# Altium schematic sheet IMU.SchDoc
size A4; Organization: Altium Limited; Address1: L3, 12a Rodborough Rd; Address2: Frenchs Forest; Address3: NSW; Address4: Australia 2086
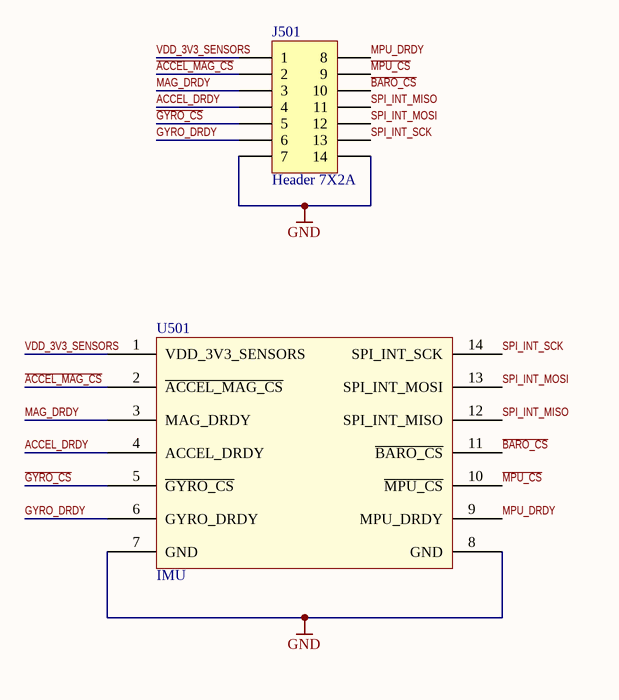
[diagram p0: IMU.SchDoc]

## Parts
J501  Header 7X2A  [smt connecter1.27-15]
U501  IMU  [IMU]

## Nets
GND: J501.7 J501.14 U501.7(GND) U501.8(GND)
~{ACCEL_MAG_CS}: J501.2 U501.2(~{ACCEL_MAG_CS})
ACCEL_DRDY: J501.4 U501.4(ACCEL_DRDY)
~{BARO_CS}: J501.10 U501.11(~{BARO_CS})
~{GYRO_CS}: J501.5 U501.5(~{GYRO_CS})
GYRO_DRDY: J501.6 U501.6(GYRO_DRDY)
~{MPU_CS}: J501.9 U501.10(~{MPU_CS})
MAG_DRDY: J501.3 U501.3(MAG_DRDY)
MPU_DRDY: J501.8 U501.9(MPU_DRDY)
SPI_INT_MISO: J501.11 U501.12(SPI_INT_MISO)
SPI_INT_MOSI: J501.12 U501.13(SPI_INT_MOSI)
SPI_INT_SCK: J501.13 U501.14(SPI_INT_SCK)
VDD_3V3_SENSORS: J501.1 U501.1(VDD_3V3_SENSORS)

## Notes on the sheet
- Title
- Size:
- Date:
- A4
- Number:
- Time:
- Revision:
- Sheet
- of
- File:

## Library data of the parts
J501 = Header 7X2A: Header, 7-Pin, Dual row; LatestRevisionDate: 17-Jul-2002; LatestRevisionNote: Re-released for DXP Platform.; Publisher: Altium Limited